# Altium schematic sheet rf_main.SchDoc: mcHF QRP Transceiver RF board
size A4; Author: K Atanassov; CompanyName: M0NKA; Revision: 0.6.3; SheetTotal: 12
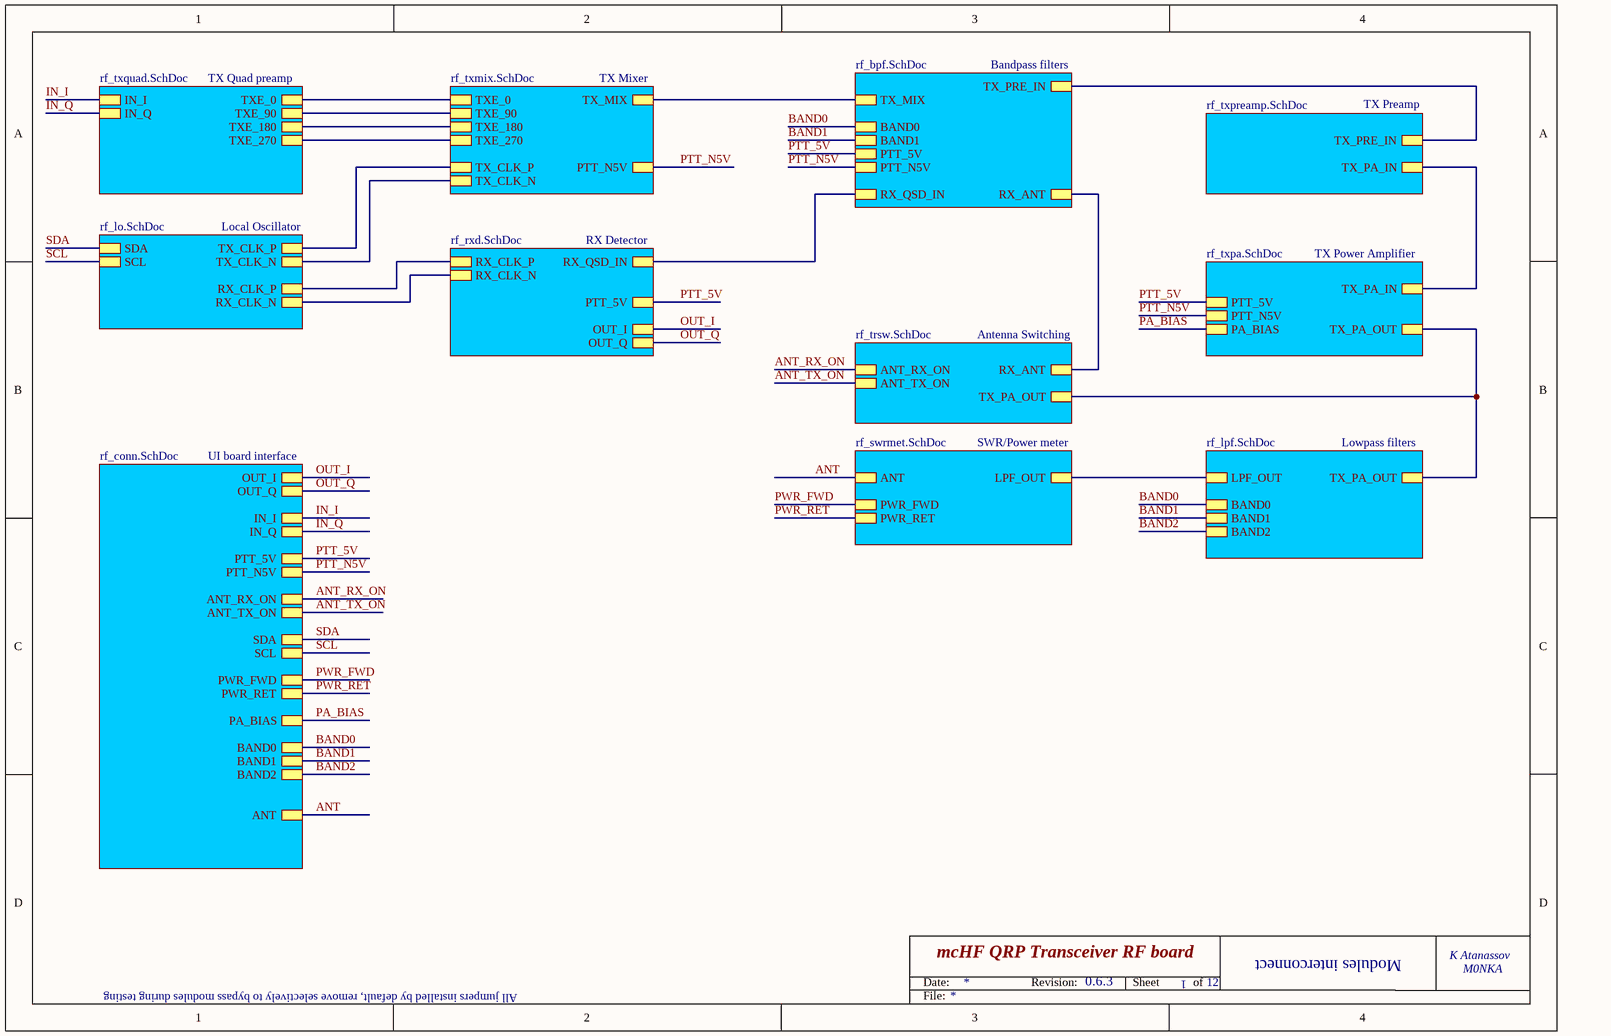
[diagram p0: rf_main.SchDoc]

## Sub-sheets
Antenna Switching = rf_trsw.SchDoc: RX_ANT, ANT_RX_ON, ANT_TX_ON, TX_PA_OUT
Bandpass filters = rf_bpf.SchDoc: RX_QSD_IN, BAND0, BAND1, PTT_5V, RX_ANT, TX_MIX, TX_PRE_IN, PTT_N5V
Local Oscillator = rf_lo.SchDoc: SDA, SCL, RX_CLK_N, RX_CLK_P, TX_CLK_P, TX_CLK_N
Lowpass filters = rf_lpf.SchDoc: TX_PA_OUT, LPF_OUT, BAND0, BAND1, BAND2
RX Detector = rf_rxd.SchDoc: RX_QSD_IN, OUT_I, OUT_Q, PTT_5V, RX_CLK_N, RX_CLK_P
SWR/Power meter = rf_swrmet.SchDoc: ANT, LPF_OUT, PWR_FWD, PWR_RET
TX Mixer = rf_txmix.SchDoc: PTT_N5V, TX_MIX, TXE_270, TXE_180, TXE_90, TXE_0, TX_CLK_P, TX_CLK_N
TX Power Amplifier = rf_txpa.SchDoc: TX_PA_IN, PA_BIAS, TX_PA_OUT, PTT_N5V, PTT_5V
TX Preamp = rf_txpreamp.SchDoc: TX_PRE_IN, TX_PA_IN
TX Quad preamp = rf_txquad.SchDoc: IN_I, IN_Q, TXE_0, TXE_90, TXE_180, TXE_270
UI board interface = rf_conn.SchDoc: OUT_I, OUT_Q, IN_I, IN_Q, PTT_5V, PTT_N5V, SDA, SCL, PWR_FWD, PWR_RET, PA_BIAS, BAND0, BAND1, ANT, BAND2, ANT_RX_ON, ANT_TX_ON

## Nets
ANT: sheet UI board interface/ANT, sheet SWR/Power meter/ANT
ANT_RX_ON: sheet UI board interface/ANT_RX_ON, sheet Antenna Switching/ANT_RX_ON
ANT_TX_ON: sheet UI board interface/ANT_TX_ON, sheet Antenna Switching/ANT_TX_ON
BAND0: sheet Bandpass filters/BAND0, sheet Lowpass filters/BAND0, sheet UI board interface/BAND0
BAND1: sheet Bandpass filters/BAND1, sheet Lowpass filters/BAND1, sheet UI board interface/BAND1
BAND2: sheet Lowpass filters/BAND2, sheet UI board interface/BAND2
IN_I: sheet TX Quad preamp/IN_I, sheet UI board interface/IN_I
IN_Q: sheet TX Quad preamp/IN_Q, sheet UI board interface/IN_Q
OUT_I: sheet RX Detector/OUT_I, sheet UI board interface/OUT_I
OUT_Q: sheet RX Detector/OUT_Q, sheet UI board interface/OUT_Q
PA_BIAS: sheet TX Power Amplifier/PA_BIAS, sheet UI board interface/PA_BIAS
PTT_5V: sheet TX Power Amplifier/PTT_5V, sheet RX Detector/PTT_5V, sheet Bandpass filters/PTT_5V, sheet UI board interface/PTT_5V
PTT_N5V: sheet TX Power Amplifier/PTT_N5V, sheet Bandpass filters/PTT_N5V, sheet UI board interface/PTT_N5V, sheet TX Mixer/PTT_N5V
PWR_FWD: sheet UI board interface/PWR_FWD, sheet SWR/Power meter/PWR_FWD
PWR_RET: sheet UI board interface/PWR_RET, sheet SWR/Power meter/PWR_RET
SCL: sheet Local Oscillator/SCL, sheet UI board interface/SCL
SDA: sheet Local Oscillator/SDA, sheet UI board interface/SDA
(unnamed): sheet TX Quad preamp/TXE_0, sheet TX Mixer/TXE_0
(unnamed): sheet TX Quad preamp/TXE_90, sheet TX Mixer/TXE_90
(unnamed): sheet TX Quad preamp/TXE_180, sheet TX Mixer/TXE_180
(unnamed): sheet TX Quad preamp/TXE_270, sheet TX Mixer/TXE_270
(unnamed): sheet TX Power Amplifier/TX_PA_IN, sheet TX Preamp/TX_PA_IN
(unnamed): sheet TX Power Amplifier/TX_PA_OUT, sheet Lowpass filters/TX_PA_OUT, sheet Antenna Switching/TX_PA_OUT
(unnamed): sheet RX Detector/RX_QSD_IN, sheet Bandpass filters/RX_QSD_IN
(unnamed): sheet RX Detector/RX_CLK_N, sheet Local Oscillator/RX_CLK_N
(unnamed): sheet RX Detector/RX_CLK_P, sheet Local Oscillator/RX_CLK_P
(unnamed): sheet Local Oscillator/TX_CLK_P, sheet TX Mixer/TX_CLK_P
(unnamed): sheet Local Oscillator/TX_CLK_N, sheet TX Mixer/TX_CLK_N
(unnamed): sheet Bandpass filters/RX_ANT, sheet Antenna Switching/RX_ANT
(unnamed): sheet Bandpass filters/TX_MIX, sheet TX Mixer/TX_MIX
(unnamed): sheet Bandpass filters/TX_PRE_IN, sheet TX Preamp/TX_PRE_IN
(unnamed): sheet Lowpass filters/LPF_OUT, sheet SWR/Power meter/LPF_OUT

## Notes on the sheet
- All jumpers installed by default, remove selectively to bypass modules during testing
- 1
- Modules interconnect
- Date:
- Revision:
- Sheet
- of
- File: